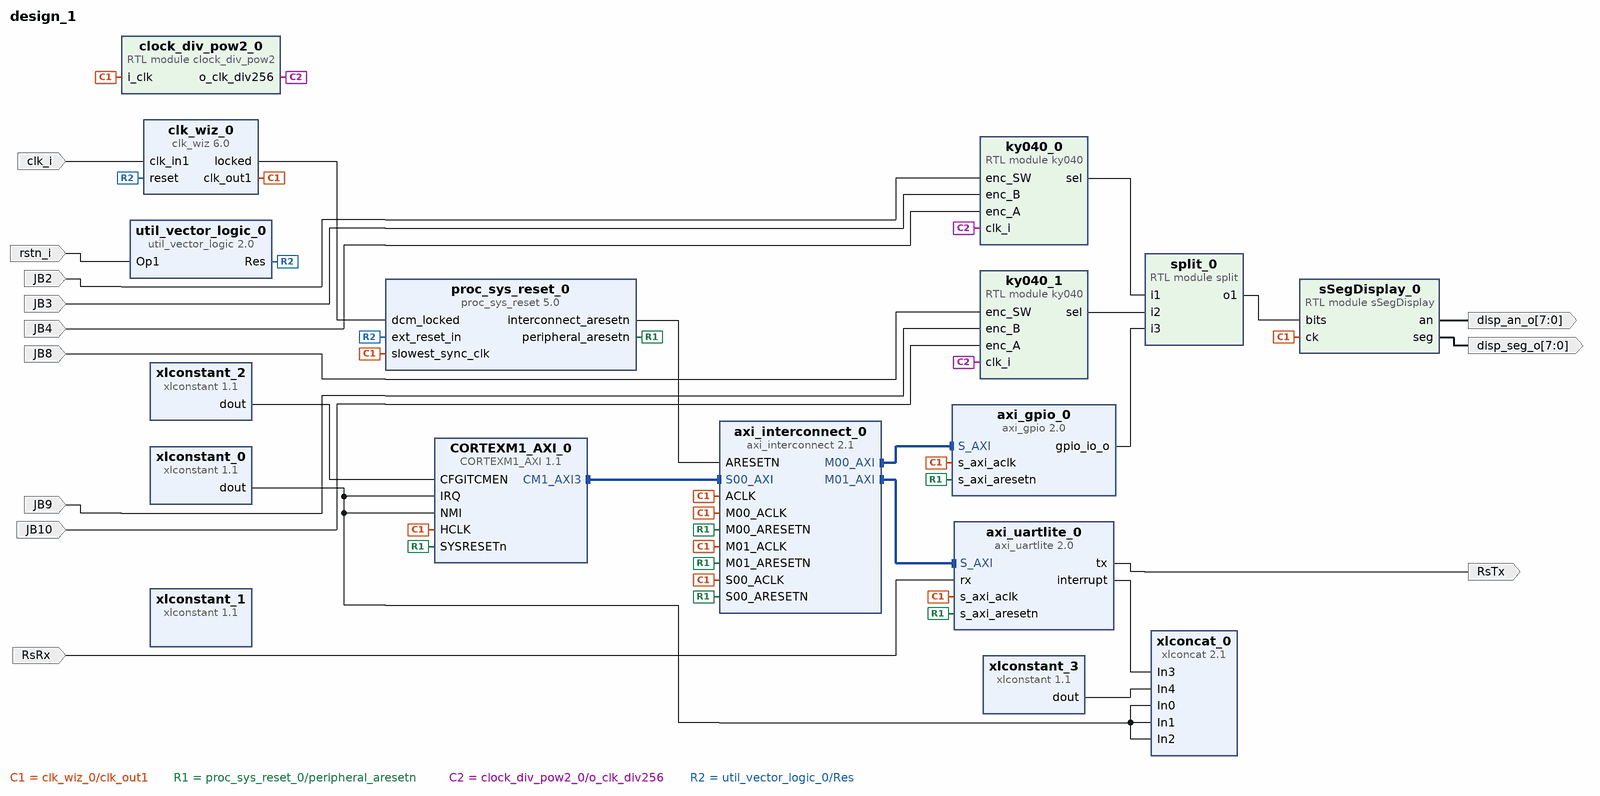
[diagram p0: block diagram of the top level]
# Vivado block design design_1, xc7a100tcsg324-1, Vivado 2019.1
create_bd_design design_1

create_bd_port -dir I -type rst rstn_i
set_property -dict {CONFIG.POLARITY ACTIVE_HIGH} [get_bd_ports rstn_i]
create_bd_port -dir I -type clk clk_i
set_property -dict {CONFIG.FREQ_HZ 100000000} [get_bd_ports clk_i]
create_bd_port -dir I JB2
create_bd_port -dir I JB3
create_bd_port -dir I JB4
create_bd_port -dir I JB8
create_bd_port -dir I JB9
create_bd_port -dir I JB10
create_bd_port -dir O -from 7 -to 0 disp_seg_o
create_bd_port -dir O -from 7 -to 0 disp_an_o
create_bd_port -dir I RsRx
create_bd_port -dir O RsTx

create_bd_cell -type ip -vlnv xilinx.com:ip:clk_wiz:6.0 clk_wiz_0
create_bd_cell -type ip -vlnv xilinx.com:ip:axi_gpio:2.0 axi_gpio_0
set_property -dict {CONFIG.C_INTERRUPT_PRESENT 0} [get_bd_cells axi_gpio_0]
create_bd_cell -type ip -vlnv xilinx.com:ip:axi_interconnect:2.1 axi_interconnect_0
set_property -dict {CONFIG.NUM_MI 2} [get_bd_cells axi_interconnect_0]
create_bd_cell -type ip -vlnv xilinx.com:ip:proc_sys_reset:5.0 proc_sys_reset_0
create_bd_cell -type ip -vlnv xilinx.com:ip:xlconcat:2.1 xlconcat_0
set_property -dict {CONFIG.IN4_WIDTH 4 CONFIG.NUM_PORTS 5} [get_bd_cells xlconcat_0]
create_bd_cell -type ip -vlnv xilinx.com:ip:xlconstant:1.1 xlconstant_1
set_property -dict {CONFIG.CONST_VAL 0 CONFIG.CONST_WIDTH 8} [get_bd_cells xlconstant_1]
create_bd_cell -type ip -vlnv xilinx.com:ip:xlconstant:1.1 xlconstant_2
set_property -dict {CONFIG.CONST_VAL 3 CONFIG.CONST_WIDTH 2} [get_bd_cells xlconstant_2]
create_bd_cell -type ip -vlnv xilinx.com:ip:axi_uartlite:2.0 axi_uartlite_0
create_bd_cell -type ip -vlnv xilinx.com:ip:xlconstant:1.1 xlconstant_3
set_property -dict {CONFIG.CONST_VAL 0 CONFIG.CONST_WIDTH 4} [get_bd_cells xlconstant_3]
create_bd_cell -type module -reference sSegDisplay sSegDisplay_0
create_bd_cell -type ip -vlnv arm.com:CortexM:CORTEXM1_AXI:1.1 CORTEXM1_AXI_0
set_property -dict {CONFIG.DEBUG_SEL 3} [get_bd_cells CORTEXM1_AXI_0]
create_bd_cell -type ip -vlnv xilinx.com:ip:xlconstant:1.1 xlconstant_0
set_property -dict {CONFIG.CONST_VAL 0} [get_bd_cells xlconstant_0]
create_bd_cell -type ip -vlnv xilinx.com:ip:util_vector_logic:2.0 util_vector_logic_0
set_property -dict {CONFIG.C_OPERATION not CONFIG.C_SIZE 1} [get_bd_cells util_vector_logic_0]
create_bd_cell -type module -reference clock_div_pow2 clock_div_pow2_0
create_bd_cell -type module -reference ky040 ky040_0
create_bd_cell -type module -reference ky040 ky040_1
create_bd_cell -type module -reference split split_0

# ---- connections ----

connect_bd_intf_net [get_bd_intf_pins axi_interconnect_0/M01_AXI] [get_bd_intf_pins axi_uartlite_0/S_AXI]
connect_bd_intf_net [get_bd_intf_pins axi_interconnect_0/M00_AXI] [get_bd_intf_pins axi_gpio_0/S_AXI]
connect_bd_intf_net [get_bd_intf_pins CORTEXM1_AXI_0/CM1_AXI3] [get_bd_intf_pins axi_interconnect_0/S00_AXI]
connect_bd_net [get_bd_ports clk_i] [get_bd_pins clk_wiz_0/clk_in1]
connect_bd_net [get_bd_pins clk_wiz_0/clk_out1] \
  [get_bd_pins proc_sys_reset_0/slowest_sync_clk] [get_bd_pins axi_interconnect_0/ACLK] \
  [get_bd_pins axi_interconnect_0/S00_ACLK] [get_bd_pins axi_interconnect_0/M00_ACLK] \
  [get_bd_pins axi_interconnect_0/M01_ACLK] [get_bd_pins axi_gpio_0/s_axi_aclk] [get_bd_pins axi_uartlite_0/s_axi_aclk] \
  [get_bd_pins CORTEXM1_AXI_0/HCLK] [get_bd_pins sSegDisplay_0/ck] [get_bd_pins clock_div_pow2_0/i_clk]
connect_bd_net [get_bd_pins clk_wiz_0/locked] [get_bd_pins proc_sys_reset_0/dcm_locked]
connect_bd_net [get_bd_pins proc_sys_reset_0/peripheral_aresetn] \
  [get_bd_pins axi_interconnect_0/S00_ARESETN] [get_bd_pins axi_interconnect_0/M00_ARESETN] \
  [get_bd_pins axi_interconnect_0/M01_ARESETN] [get_bd_pins axi_uartlite_0/s_axi_aresetn] \
  [get_bd_pins axi_gpio_0/s_axi_aresetn] [get_bd_pins CORTEXM1_AXI_0/SYSRESETn]
connect_bd_net [get_bd_pins proc_sys_reset_0/interconnect_aresetn] [get_bd_pins axi_interconnect_0/ARESETN]
connect_bd_net [get_bd_pins xlconstant_3/dout] [get_bd_pins xlconcat_0/In4]
connect_bd_net [get_bd_pins axi_uartlite_0/interrupt] [get_bd_pins xlconcat_0/In3]
connect_bd_net [get_bd_pins sSegDisplay_0/seg] [get_bd_ports disp_seg_o]
connect_bd_net [get_bd_pins sSegDisplay_0/an] [get_bd_ports disp_an_o]
connect_bd_net -net C4_1 [get_bd_ports RsRx] [get_bd_pins axi_uartlite_0/rx]
connect_bd_net [get_bd_pins axi_uartlite_0/tx] [get_bd_ports RsTx]
connect_bd_net [get_bd_pins xlconstant_2/dout] [get_bd_pins CORTEXM1_AXI_0/CFGITCMEN]
connect_bd_net [get_bd_pins xlconstant_0/dout] \
  [get_bd_pins CORTEXM1_AXI_0/NMI] [get_bd_pins xlconcat_0/In0] [get_bd_pins CORTEXM1_AXI_0/IRQ] [get_bd_pins xlconcat_0/In1] \
  [get_bd_pins xlconcat_0/In2]
connect_bd_net [get_bd_ports rstn_i] [get_bd_pins util_vector_logic_0/Op1]
connect_bd_net -net JB2_1 [get_bd_ports JB2] [get_bd_pins ky040_0/enc_SW]
connect_bd_net -net JB3_1 [get_bd_ports JB3] [get_bd_pins ky040_0/enc_B]
connect_bd_net -net JB4_1 [get_bd_ports JB4] [get_bd_pins ky040_0/enc_A]
connect_bd_net [get_bd_pins clock_div_pow2_0/o_clk_div256] [get_bd_pins ky040_0/clk_i] [get_bd_pins ky040_1/clk_i]
connect_bd_net -net JB8_1 [get_bd_ports JB8] [get_bd_pins ky040_1/enc_SW]
connect_bd_net -net JB9_1 [get_bd_ports JB9] [get_bd_pins ky040_1/enc_B]
connect_bd_net -net JB10_1 [get_bd_ports JB10] [get_bd_pins ky040_1/enc_A]
connect_bd_net [get_bd_pins ky040_0/sel] [get_bd_pins split_0/i1]
connect_bd_net [get_bd_pins ky040_1/sel] [get_bd_pins split_0/i2]
connect_bd_net [get_bd_pins util_vector_logic_0/Res] [get_bd_pins clk_wiz_0/reset] [get_bd_pins proc_sys_reset_0/ext_reset_in]
connect_bd_net [get_bd_pins split_0/o1] [get_bd_pins sSegDisplay_0/bits]
connect_bd_net [get_bd_pins axi_gpio_0/gpio_io_o] [get_bd_pins split_0/i3]

# ---- address map ----
assign_bd_address -offset 0x40000000 -range 64K -target_address_space [get_bd_addr_spaces CORTEXM1_AXI_0/CM1_AXI3] [get_bd_addr_segs axi_gpio_0/S_AXI/Reg]
assign_bd_address -offset 0x40600000 -range 64K -target_address_space [get_bd_addr_spaces CORTEXM1_AXI_0/CM1_AXI3] [get_bd_addr_segs axi_uartlite_0/S_AXI/Reg]

validate_bd_design
save_bd_design
